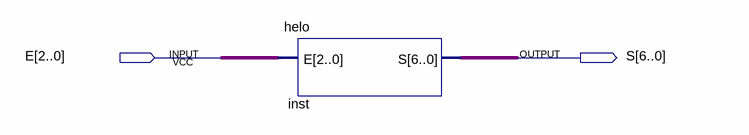
[diagram p0: schematic sheet]
// Quartus schematic helo_SCHEME.bdf as structural Verilog: 1 symbols, 2 pins
module helo_SCHEME (
  input  [2:0] E,
  output [6:0] S
);

  helo inst (.E(E), .S(S));
endmodule
